# Altium schematic sheet MT7688.SchDoc
size A4 portrait
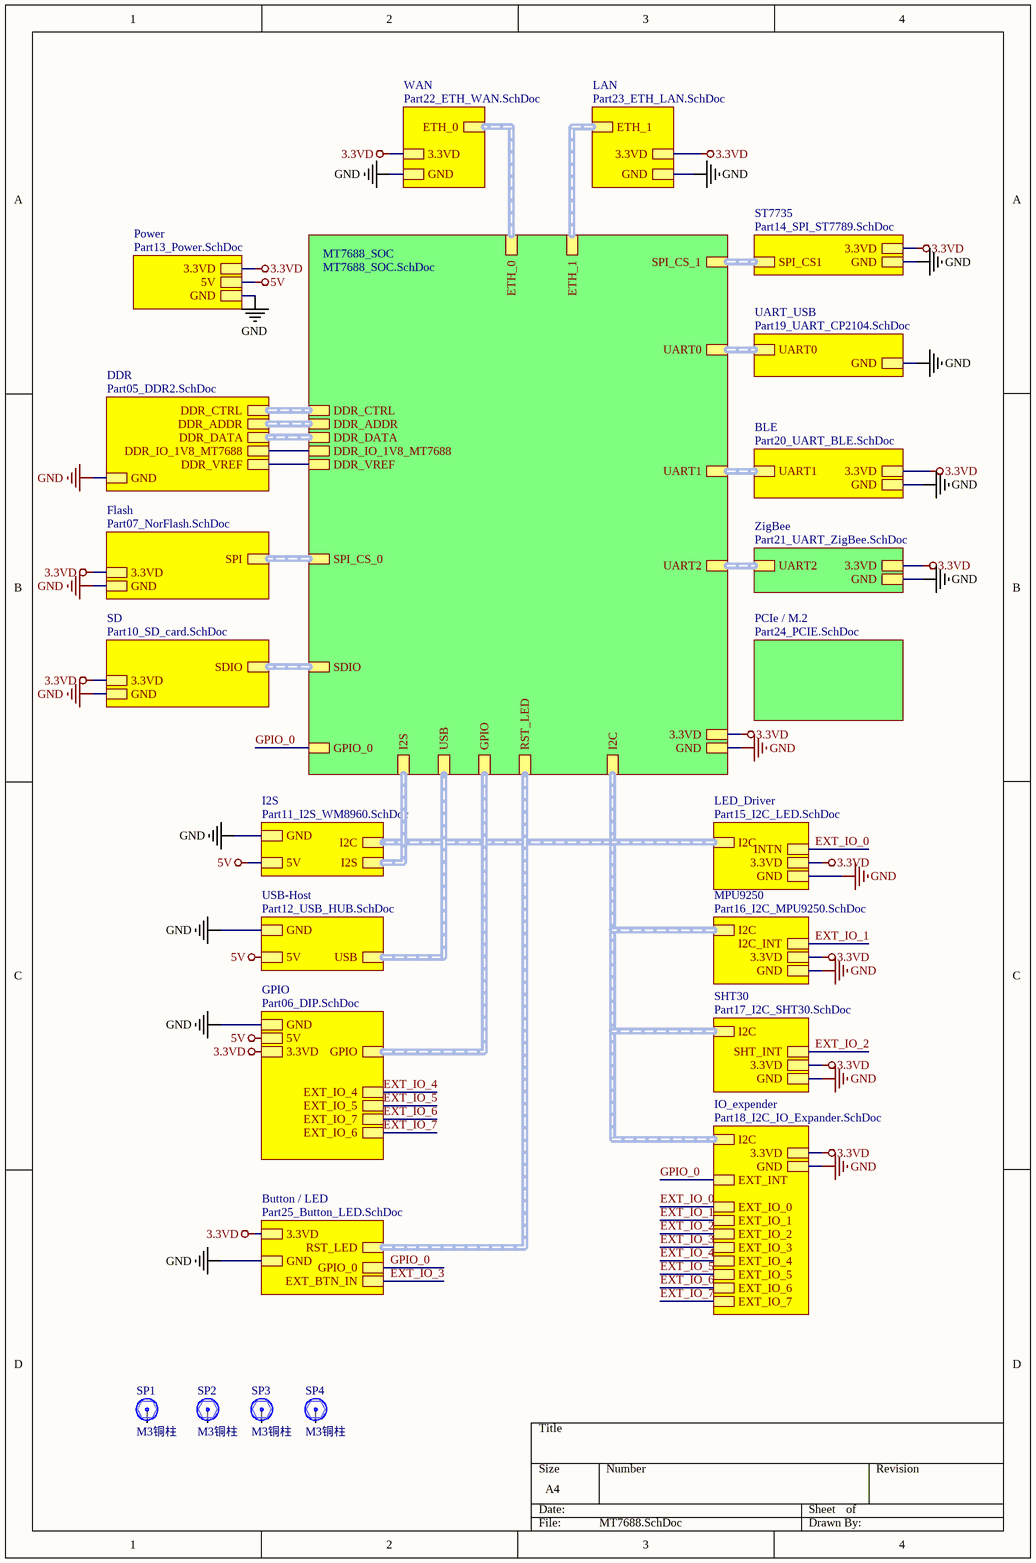
[diagram p0: MT7688.SchDoc]

## Parts
SP1  M3铜柱  [M3x5_N]
SP2  M3铜柱  [M3x5_N]
SP3  M3铜柱  [M3x5_N]
SP4  M3铜柱  [M3x5_N]

## Sub-sheets
BLE = Part20_UART_BLE.SchDoc: 3.3VD, UART1 (harness UART1), GND
Button / LED = Part25_Button_LED.SchDoc: GND, 3.3VD, RST_LED (harness RST), GPIO_0, EXT_BTN_IN
DDR = Part05_DDR2.SchDoc: DDR_CTRL (harness DDR_CTRL), DDR_ADDR (harness DDR_ADDR), DDR_DATA (harness DDR_DATA), DDR_IO_1V8_MT7688, DDR_VREF, GND
Flash = Part07_NorFlash.SchDoc: GND, SPI (harness SPI_CS_0), 3.3VD
GPIO = Part06_DIP.SchDoc: GPIO (harness GPIO), GND, 5V, 3.3VD, EXT_IO_4, EXT_IO_5, EXT_IO_7, EXT_IO_6
I2S = Part11_I2S_WM8960.SchDoc: 5V, I2S (harness I2S), GND, I2C (harness I2C)
IO_expender = Part18_I2C_IO_Expander.SchDoc: GND, 3.3VD, I2C (harness I2C), EXT_INT, EXT_IO_3, EXT_IO_6, EXT_IO_7, EXT_IO_5, EXT_IO_2, EXT_IO_0, EXT_IO_1, EXT_IO_4
LAN = Part23_ETH_LAN.SchDoc: GND, ETH_1 (harness ETH_1), 3.3VD
LED_Driver = Part15_I2C_LED.SchDoc: GND, I2C (harness I2C), 3.3VD, INTN
MPU9250 = Part16_I2C_MPU9250.SchDoc: I2C (harness I2C), 3.3VD, GND, I2C_INT
MT7688_SOC = MT7688_SOC.SchDoc: I2S, GPIO, UART0, DDR_IO_1V8_MT7688, GND, ETH_1, I2C, SPI_CS_1, SDIO, USB, DDR_CTRL, UART2, UART1, SPI_CS_0, ETH_0, DDR_DATA, DDR_ADDR, DDR_VREF, 3.3VD, GPIO_0, RST_LED
PCIe / M.2 = Part24_PCIE.SchDoc: no entries
Power = Part13_Power.SchDoc: GND, 3.3VD, 5V
SD = Part10_SD_card.SchDoc: 3.3VD, GND, SDIO (harness SDIO)
SHT30 = Part17_I2C_SHT30.SchDoc: 3.3VD, GND, I2C (harness I2C), SHT_INT
ST7735 = Part14_SPI_ST7789.SchDoc: 3.3VD, SPI_CS1 (harness SPI_CS_1), GND
UART_USB = Part19_UART_CP2104.SchDoc: UART0 (harness UART0), GND
USB-Host = Part12_USB_HUB.SchDoc: GND, 5V, USB (harness USB)
WAN = Part22_ETH_WAN.SchDoc: 3.3VD, GND, ETH_0 (harness ETH_0)
ZigBee = Part21_UART_ZigBee.SchDoc: UART2 (harness UART2), GND, 3.3VD

## Nets
3.3VD: sheet MT7688_SOC/3.3VD, sheet Power/3.3VD, sheet WAN/3.3VD, sheet Flash/3.3VD, sheet Button / LED/3.3VD, sheet LAN/3.3VD, sheet GPIO/3.3VD, sheet ST7735/3.3VD, sheet BLE/3.3VD, sheet SD/3.3VD, sheet ZigBee/3.3VD, sheet IO_expender/3.3VD, sheet LED_Driver/3.3VD, sheet MPU9250/3.3VD, sheet SHT30/3.3VD
5V: sheet Power/5V, sheet GPIO/5V, sheet I2S/5V, sheet USB-Host/5V
GND: sheet MT7688_SOC/GND, sheet Power/GND, sheet DDR/GND, sheet WAN/GND, sheet Flash/GND, sheet Button / LED/GND, sheet LAN/GND, sheet GPIO/GND, sheet I2S/GND, sheet ST7735/GND, sheet BLE/GND, sheet SD/GND, sheet USB-Host/GND, sheet ZigBee/GND, sheet IO_expender/GND, sheet LED_Driver/GND, sheet MPU9250/GND, sheet SHT30/GND, sheet UART_USB/GND
EXT_IO_0: sheet IO_expender/EXT_IO_0, sheet LED_Driver/INTN
EXT_IO_1: sheet IO_expender/EXT_IO_1, sheet MPU9250/I2C_INT
EXT_IO_2: sheet IO_expender/EXT_IO_2, sheet SHT30/SHT_INT
EXT_IO_3: sheet Button / LED/EXT_BTN_IN, sheet IO_expender/EXT_IO_3
EXT_IO_4: sheet GPIO/EXT_IO_4, sheet IO_expender/EXT_IO_4
EXT_IO_5: sheet GPIO/EXT_IO_5, sheet IO_expender/EXT_IO_5
EXT_IO_6: sheet GPIO/EXT_IO_7, sheet IO_expender/EXT_IO_6
EXT_IO_7: sheet GPIO/EXT_IO_6, sheet IO_expender/EXT_IO_7
GPIO_0: sheet MT7688_SOC/GPIO_0, sheet Button / LED/GPIO_0, sheet IO_expender/EXT_INT
(unnamed): sheet MT7688_SOC/DDR_IO_1V8_MT7688, sheet DDR/DDR_IO_1V8_MT7688
(unnamed): sheet MT7688_SOC/DDR_VREF, sheet DDR/DDR_VREF

Not connected (* = marked no-connect by the designer): SP1 1; SP2 1; SP3 1; SP4 1

## Buses and harness runs
harness sheet BLE/UART1 = sheet MT7688_SOC/UART1
harness sheet Button / LED/RST_LED = sheet MT7688_SOC/RST_LED
harness sheet DDR/DDR_ADDR = sheet MT7688_SOC/DDR_ADDR
harness sheet DDR/DDR_CTRL = sheet MT7688_SOC/DDR_CTRL
harness sheet DDR/DDR_DATA = sheet MT7688_SOC/DDR_DATA
harness sheet Flash/SPI = sheet MT7688_SOC/SPI_CS_0
harness sheet GPIO/GPIO = sheet MT7688_SOC/GPIO
harness sheet I2S/I2C = sheet IO_expender/I2C = sheet LED_Driver/I2C = sheet MPU9250/I2C = sheet MT7688_SOC/I2C = sheet SHT30/I2C
harness sheet I2S/I2S = sheet MT7688_SOC/I2S
harness sheet LAN/ETH_1 = sheet MT7688_SOC/ETH_1
harness sheet MT7688_SOC/ETH_0 = sheet WAN/ETH_0
harness sheet MT7688_SOC/SDIO = sheet SD/SDIO
harness sheet MT7688_SOC/SPI_CS_1 = sheet ST7735/SPI_CS1
harness sheet MT7688_SOC/UART0 = sheet UART_USB/UART0
harness sheet MT7688_SOC/UART2 = sheet ZigBee/UART2
harness sheet MT7688_SOC/USB = sheet USB-Host/USB

## Library data of the parts
SP1-SP4 = 铜柱大焊盘: 铜柱; 版权归属: 源创客; BOM名称: 铜柱; 学习资源: www.ooocke.com